# EAGLE design plotter (EAGLE 9.5.1)
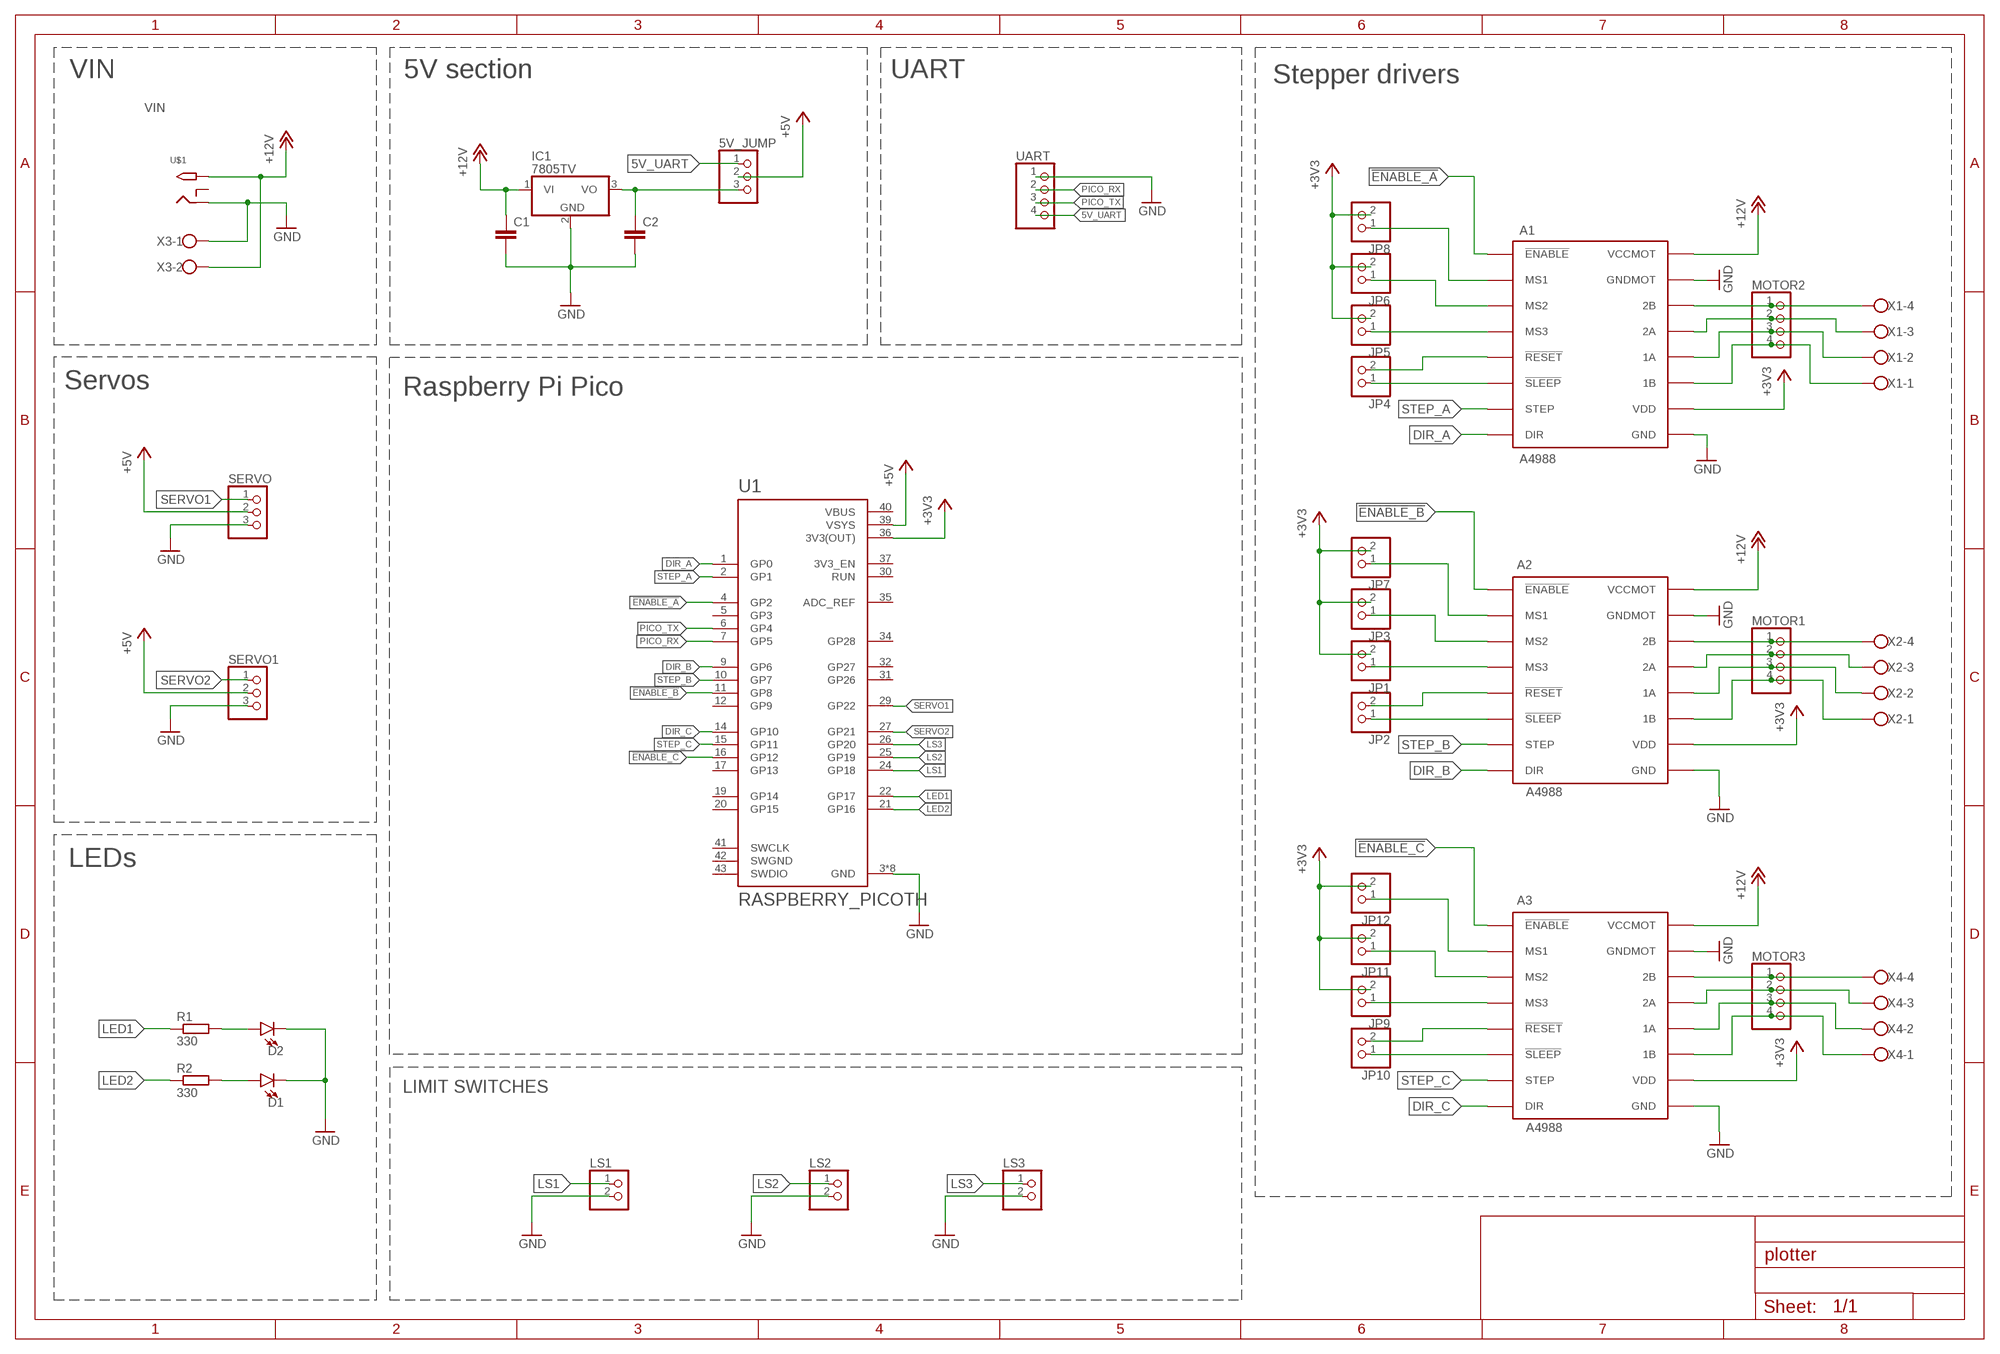
[diagram p0: schematic, sheet 1]

## Parts
5V_JUMP  PINHD-1X3  [1X03]
A1  A4988  [A4988]
A2  A4988  [A4988]
A3  A4988  [A4988]
C1  C-EUC0805  [C0805]
C2  C-EUC0805  [C0805]
D1  LED5MM  [LED_5MM]
D2  LED5MM  [LED_5MM]
IC1  7805TV  [TO220V]
JP1  PINHD-1X2  [1X02]
JP2  PINHD-1X2  [1X02]
JP3  PINHD-1X2  [1X02]
JP4  PINHD-1X2  [1X02]
JP5  PINHD-1X2  [1X02]
JP6  PINHD-1X2  [1X02]
JP7  PINHD-1X2  [1X02]
JP8  PINHD-1X2  [1X02]
JP9  PINHD-1X2  [1X02]
JP10  PINHD-1X2  [1X02]
JP11  PINHD-1X2  [1X02]
JP12  PINHD-1X2  [1X02]
LS1  PINHD-1X2  [1X02]
LS2  PINHD-1X2  [1X02]
LS3  PINHD-1X2  [1X02]
MOTOR1  PINHD-1X4  [1X04]
MOTOR2  PINHD-1X4  [1X04]
MOTOR3  PINHD-1X4  [1X04]
R1  330  R-EU_R0805  [R0805]
R2  330  R-EU_R0805  [R0805]
SERVO  PINHD-1X3  [1X03]
SERVO1  PINHD-1X3  [1X03]
U1  RASPBERRY_PICOTH  [PICO-PKG-TH]
U$1  2.1MMJACKTHM  [PJ-102A]
UART  PINHD-1X4  [1X04]
X1  W237-4  [W237-4]
X2  W237-4  [W237-4]
X3  W237-102  [W237-102]
X4  W237-4  [W237-4]

## Nets
5V_UART: 5V_JUMP.1 UART.4
!ENABLE_A: A1.!ENABLE U1.4(GP2)
!ENABLE_B: A2.!ENABLE U1.11(GP8)
!ENABLE_C: A3.!ENABLE U1.16(GP12)
+3V3: A1.VDD A2.VDD A3.VDD JP1.2 JP3.2 JP5.2 JP6.2 JP7.2 JP8.2 JP9.2 JP11.2 JP12.2 U1.36(3V3(OUT))
+5V: 5V_JUMP.2 SERVO1.2 SERVO.2 U1.39(VSYS)
+12V: A1.VCCMOT A2.VCCMOT A3.VCCMOT C1.1 IC1.1(VI) U$1.TIP X3.2
DIR_A: A1.DIR U1.1(GP0)
DIR_B: A2.DIR U1.9(GP6)
DIR_C: A3.DIR U1.14(GP10)
GND: A1.GND A1.GNDMOT A2.GND A2.GNDMOT A3.GND A3.GNDMOT C1.2 C2.2 D1.K(C) D2.K(C) IC1.2(GND) LS1.2 LS2.2 LS3.2 SERVO1.3 SERVO.3 U1.3(GND) U1.8(GND) U1.13(GND) U1.18(GND) U1.23(GND) U1.28(GND) U1.33(GND) U1.38(GND) U$1.RING UART.1 X3.1
LED1: R1.1 U1.22(GP17)
LED2: R2.1 U1.21(GP16)
LS1: LS1.1 U1.24(GP18)
LS2: LS2.1 U1.25(GP19)
LS3: LS3.1 U1.26(GP20)
N$1: A1.2B MOTOR2.1 X1.4
N$2: A1.2A MOTOR2.2 X1.3
N$3: A1.1A MOTOR2.3 X1.2
N$4: A1.1B MOTOR2.4 X1.1
N$5: A2.2B MOTOR1.1 X2.4
N$6: A2.2A MOTOR1.2 X2.3
N$7: A2.1A MOTOR1.3 X2.2
N$8: A2.1B MOTOR1.4 X2.1
N$9: 5V_JUMP.3 C2.1 IC1.3(VO)
N$10: D2.A R1.2
N$11: D1.A R2.2
N$12: A2.!SLEEP JP2.1
N$13: A2.!RESET JP2.2
N$14: A2.MS3 JP1.1
N$15: A2.MS2 JP3.1
N$16: A2.MS1 JP7.1
N$17: A1.!SLEEP JP4.1
N$18: A1.!RESET JP4.2
N$19: A1.MS3 JP5.1
N$20: A1.MS2 JP6.1
N$21: A1.MS1 JP8.1
N$22: A3.2B MOTOR3.1 X4.4
N$23: A3.2A MOTOR3.2 X4.3
N$24: A3.1A MOTOR3.3 X4.2
N$25: A3.1B MOTOR3.4 X4.1
N$26: A3.!SLEEP JP10.1
N$27: A3.!RESET JP10.2
N$28: A3.MS3 JP9.1
N$29: A3.MS2 JP11.1
N$30: A3.MS1 JP12.1
PICO_RX: U1.7(GP5) UART.2
PICO_TX: U1.6(GP4) UART.3
SERVO1: SERVO.1 U1.29(GP22)
SERVO2: SERVO1.1 U1.27(GP21)
STEP_A: A1.STEP U1.2(GP1)
STEP_B: A2.STEP U1.10(GP7)
STEP_C: A3.STEP U1.15(GP11)
Unconnected: U1.5(GP3) U1.12(GP9) U1.17(GP13) U1.19(GP14) U1.20(GP15) U1.30(RUN) U1.31(GP26) U1.32(GP27) U1.34(GP28) U1.35(ADC_REF) U1.37(3V3_EN) U1.41(SWCLK) U1.43(SWDIO) U$1.RING_SW

## Notes on the sheet
- VIN | 5V section | UART | Stepper drivers
- VIN
- Servos | Raspberry Pi Pico
- LEDs
- LIMIT SWITCHES

## Power pins joined to a net without a drawn wire
SWGND: U1.42(SWGND)
VBUS: U1.40(VBUS)

## Library data of the parts
5V_JUMP SERVO SERVO1 = pinhead:PINHD-1X3: PIN HEADER
A1-A3 = NikodemBartnik:A4988
C1 C2 = rcl:C-EU: CAPACITOR, European symbol; SPICEPREFIX: C
D1 D2 = SparkFun-LED:LED: LED (Generic) Standard schematic elements and footprints for 5mm, 3mm, 1206, and 0603 sized LEDs. Generic LEDs with no color specified.
IC1 = linear:78*: Positive VOLTAGE REGULATOR Source: http://cache.national.com/ds/LM/LM78L05.pdf http://www.fairchildsemi.com/ds/LM/LM7805.pdf
JP1-JP12 LS1-LS3 = pinhead:PINHD-1X2: PIN HEADER
MOTOR1-MOTOR3 UART = pinhead:PINHD-1X4: PIN HEADER
R1 R2 = rcl:R-EU_: RESISTOR, European symbol; SPICEPREFIX: R
U1 = RpiPico:RASPBERRY_PICO: Raspberry Pi Pico
U$1 = adafruit:2.1MMJACK: 2.1mm x 5.5mm THM DC jack with internal switch. Digikey part #PJ-102A, 4UCON part #05537 2.1mm x 5.5mm SMT DC jack with internal switch. Digikey part #PJ-002A-SMT, 4UCON part #03267 By microbuilder.eu & adafruit.com
X1 X2 X4 = con-wago-500:W237-4: WAGO SCREW CLAMP; OC_FARNELL: unknown; OC_NEWARK: unknown
X3 = con-wago-500:W237-102: WAGO SCREW CLAMP; MPN: 237-102; OC_FARNELL: unknown; OC_NEWARK: 70K9898

## Board
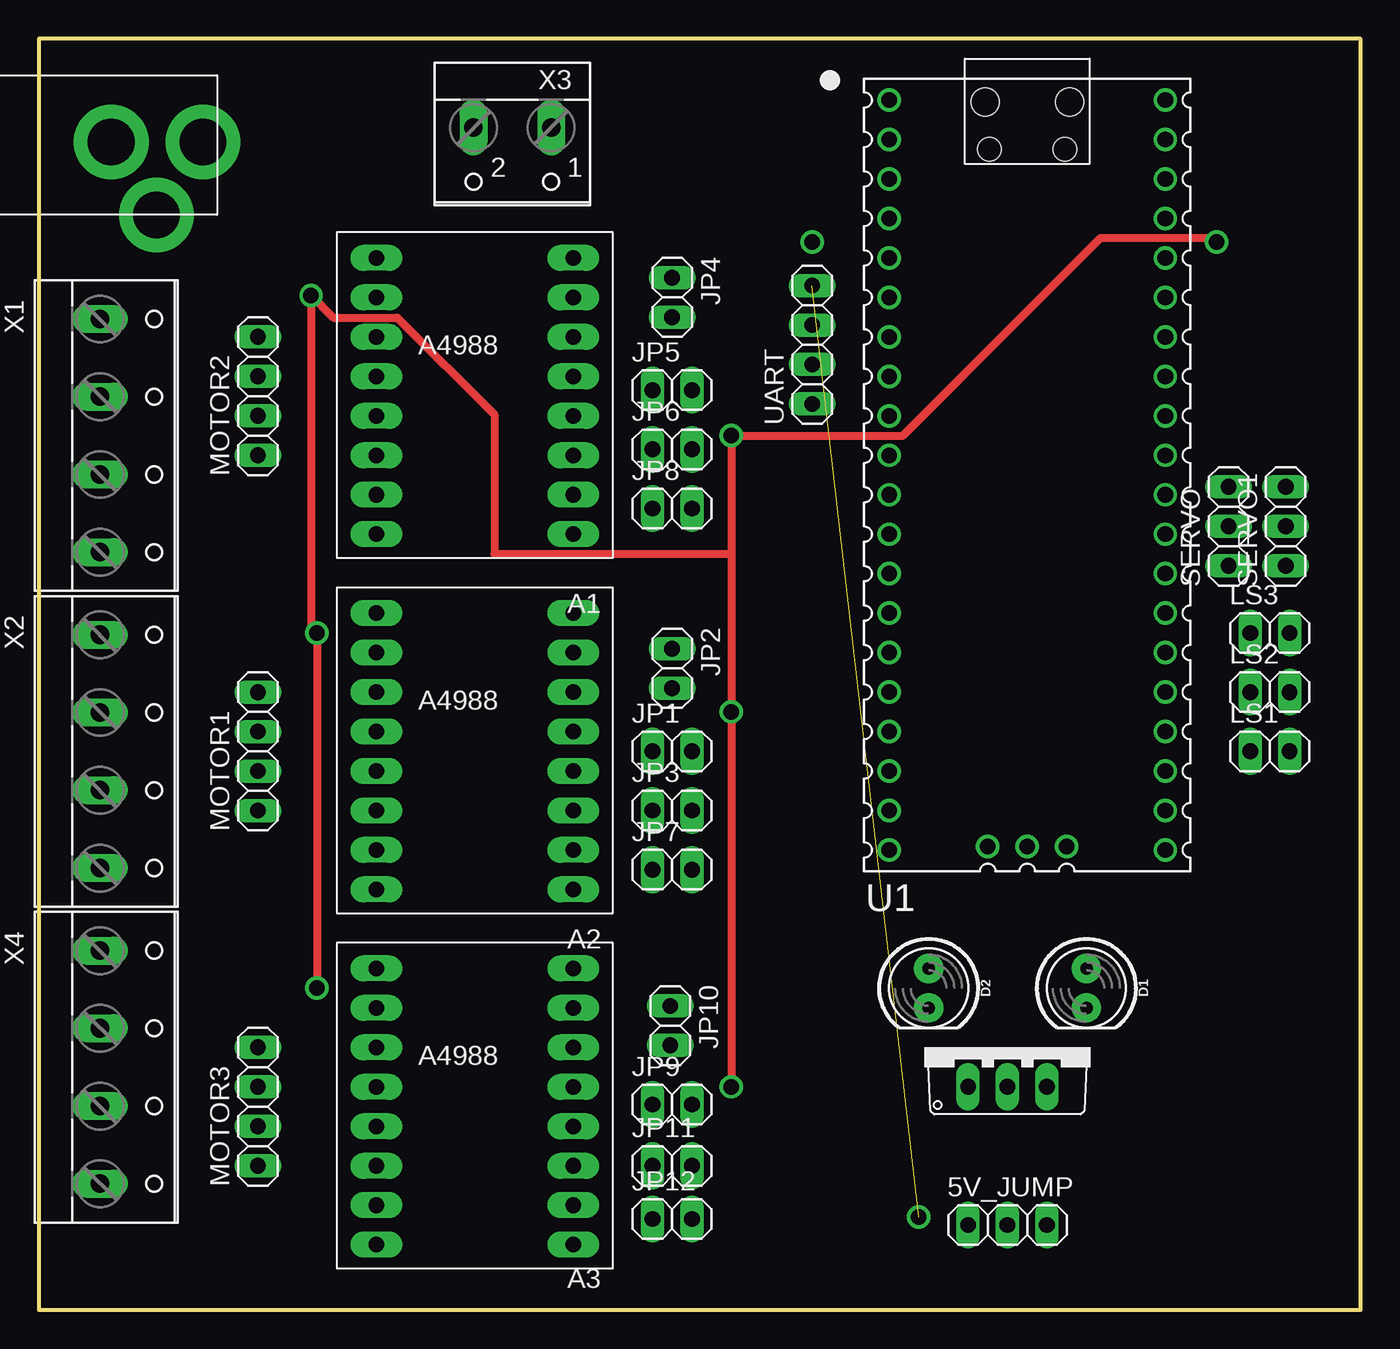
[diagram p1: board, top side]
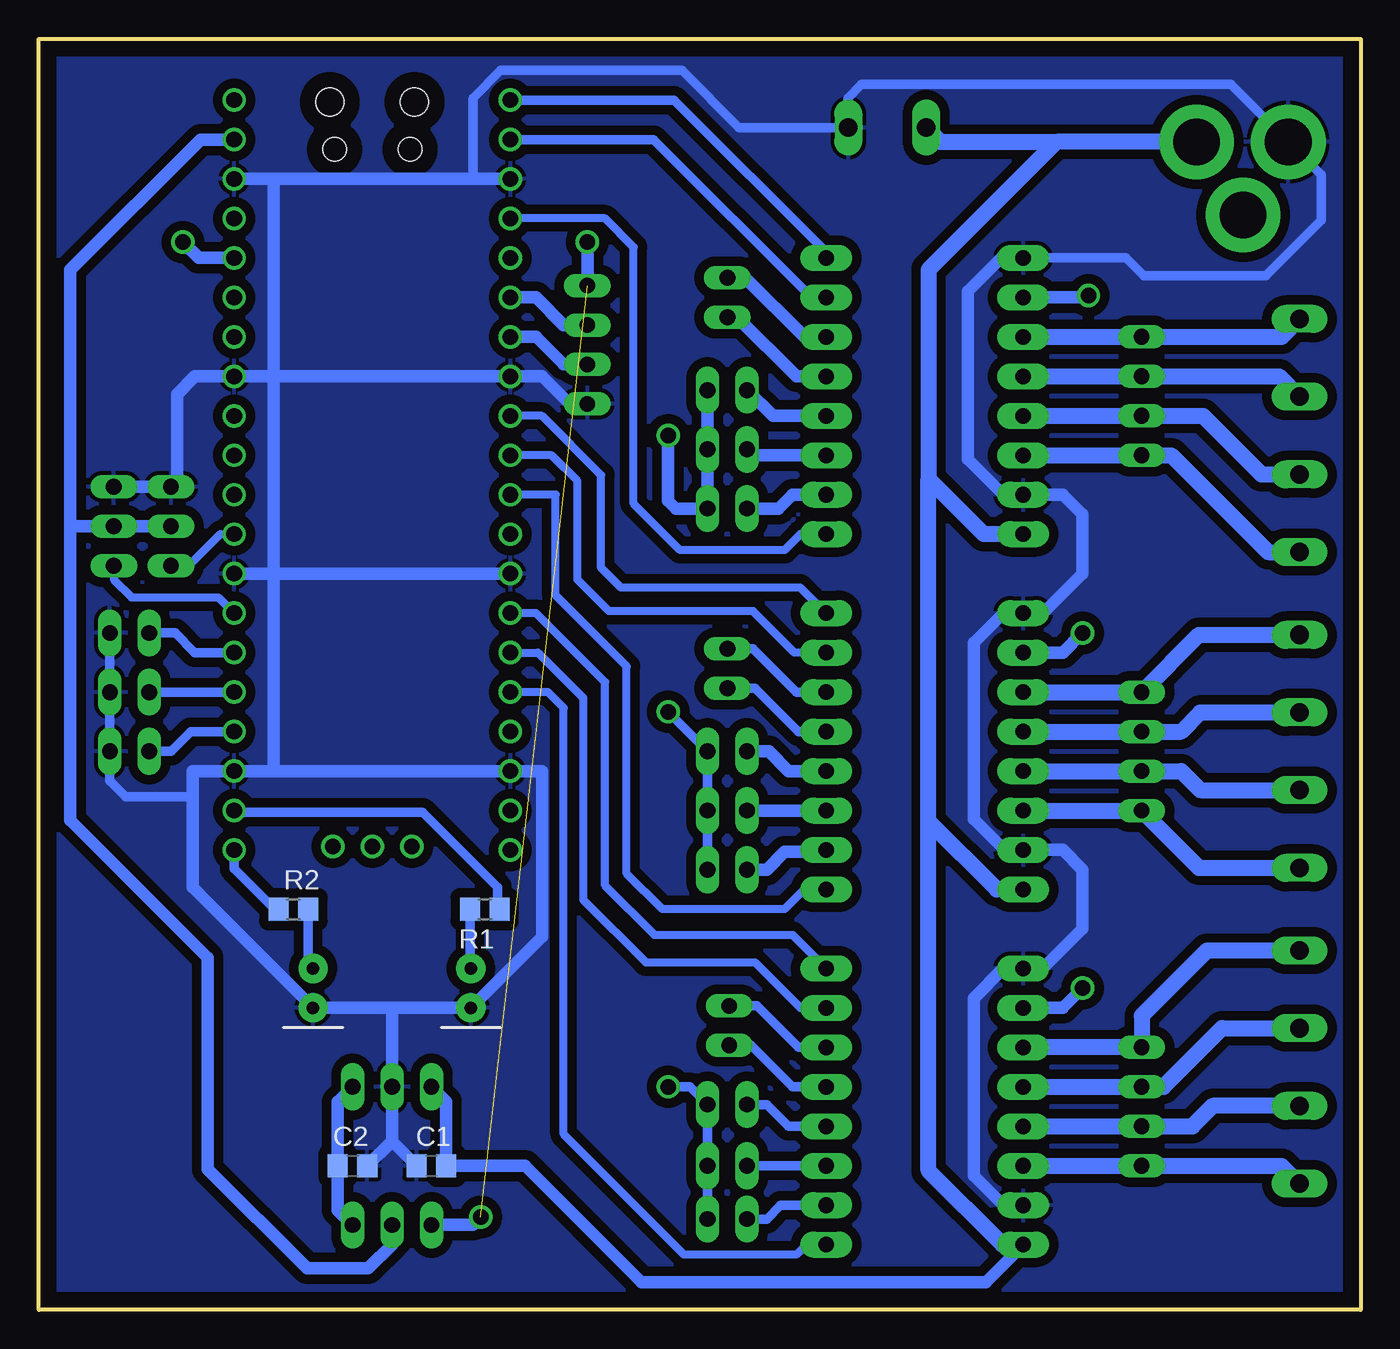
[diagram p2: board, bottom side, seen from below]

Size 85.09 x 81.79 mm. Coordinates in mm from the lower left corner, seen from the top.
Outline: 0,81.79 0,0 85.09,0 85.09,81.79 0,81.79
Copper layers (1*16): Top 0.035mm / dielectric 1.5mm / Bottom 0.035mm
Design rules "default": minimum track width 6mil, minimum drill 0.35mm, track to track 6mil, track to pad 6mil, pad to pad 6mil, via to via 6mil, smd to smd 6mil, copper to edge 40mil, drill to drill 6mil, minimum pad ring 10mil, minimum via ring 8mil, stop-mask expansion 4mil, vias tented up to drill 0mil, thermal gap 10mil

### Footprints (pad centres in the part's own frame; a part is rotated, then mirrored left to right if it is on the bottom)
1X03 = drill 1.016 long: 1 -2.54,0; 2 0,0; 3 2.54,0
A4988 = drill 1 pad 1.676 long: 1A 6.35,-1.27; 1B 6.35,-3.81; 2A 6.35,1.27; 2B 6.35,3.81; !ENABLE -6.35,8.89; !RESET -6.35,-1.27; !SLEEP -6.35,-3.81; DIR -6.35,-8.89; GND 6.35,-8.89; GNDMOT 6.35,6.35; MS1 -6.35,6.35; MS2 -6.35,3.81; MS3 -6.35,1.27; STEP -6.35,-6.35; VCCMOT 6.35,8.89; VDD 6.35,-6.35
C0805 = smd 1.3 x 1.5: 1 -0.95,0; 2 0.95,0
LED_5MM = drill 0.813 pad 1.88: A -1.27,0; K 1.27,0
TO220V = drill 1.016 long: 1 -2.54,-2.54; 2 0,-2.54; 3 2.54,-2.54
1X02 = drill 1.016 long: 1 -1.27,0; 2 1.27,0
1X04 = drill 1.016 long: 1 -3.81,0; 2 -1.27,0; 3 1.27,0; 4 3.81,0
R0805 = smd 1.3 x 1.5: 1 -0.95,0; 2 0.95,0
PICO-PKG-TH = drill 1: 1 -8.89,24.13; 2 -8.89,21.59; 3 -8.89,19.05; 4 -8.89,16.51; 5 -8.89,13.97; 6 -8.89,11.43; 7 -8.89,8.89; 8 -8.89,6.35; 9 -8.89,3.81; 10 -8.89,1.27; 11 -8.89,-1.27; 12 -8.89,-3.81; 13 -8.89,-6.35; 14 -8.89,-8.89; 15 -8.89,-11.43; 16 -8.89,-13.97; 17 -8.89,-16.51; 18 -8.89,-19.05; 19 -8.89,-21.59; 20 -8.89,-24.13; 21 8.89,-24.13; 22 8.89,-21.59; 23 8.89,-19.05; 24 8.89,-16.51; 25 8.89,-13.97; 26 8.89,-11.43; 27 8.89,-8.89; 28 8.89,-6.35; 29 8.89,-3.81; 30 8.89,-1.27; 31 8.89,1.27; 32 8.89,3.81; 33 8.89,6.35; 34 8.89,8.89; 35 8.89,11.43; 36 8.89,13.97; 37 8.89,16.51; 38 8.89,19.05; 39 8.89,21.59; 40 8.89,24.13; 41 -2.54,-23.9; 42 0,-23.9; 43 2.54,-23.9 | hole 1.8: -2.725,24; 2.725,24 | hole 1.5: -2.425,20.97; 2.425,20.97
PJ-102A = drill 3 pad 4.8: RING 0.1,-3.39; RING_SW -4.6,-6.29; TIP 0.1,-9.29
W237-4 = drill 1.194 long: 1 -7.5,-1.27; 2 -2.5,-1.27; 3 2.5,-1.27; 4 7.5,-1.27
W237-102 = drill 1.194 long: 1 -2.5,-1.27; 2 2.5,-1.27

### Placement (x,y rotation side)
5V_JUMP  62.36,5.46 0 top
A1  28.07,58.8 180 top
A2  28.07,35.94 180 top
A3  28.07,13.08 180 top
C1  59.82,9.27 180 bottom
C2  64.9,9.27 0 bottom
D1  67.44,20.7 270 top
D2  57.28,20.7 270 top
IC1  62.36,16.89 0 top
JP1  40.77,35.94 0 top
JP2  40.77,41.27 270 top
JP3  40.77,32.13 0 top
JP4  40.77,65.15 270 top
JP5  40.77,59.18 0 top
JP6  40.77,55.37 0 top
JP7  40.77,28.32 0 top
JP8  40.77,51.56 0 top
JP9  40.77,13.21 0 top
JP10  40.64,18.29 270 top
JP11  40.77,9.27 0 top
JP12  40.77,5.84 0 top
LS1  79.25,35.94 0 top
LS2  79.25,39.75 0 top
LS3  79.25,43.56 0 top
MOTOR1  14.1,35.94 90 top
MOTOR2  14.1,58.8 90 top
MOTOR3  14.1,13.08 90 top
R1  56.39,25.78 180 bottom
R2  68.71,25.78 0 bottom
SERVO  76.58,50.42 90 top
SERVO1  80.26,50.42 90 top
U1  63.63,53.72 0 top
U$1  1.27,75.06 90 top
UART  49.78,62.1 90 top
X1  5.21,56.26 270 top
X2  5.21,35.94 270 top
X3  30.48,74.8 180 top
X4  5.21,15.62 270 top

### Tracks (layer width: path | path; a pad name or v marks a point on that pad's centre or on a via)
5V_UART  (via drill 1)  (1 unrouted)
  Bottom 0.61: 49.02,65.91 UART.4
  Bottom 0.813: 5V_JUMP.1 57.15,5.46 v56.64,5.97 | v49.78,68.71 UART.4
!ENABLE_A
  Bottom 0.508: A1.!ENABLE 36.07,49.91 37.08,48.89 43.81,48.89 46.8,51.88 46.8,68.39 48.64,70.23 U1.4
!ENABLE_B
  Bottom 0.508: A2.!ENABLE 35.81,27.05 37.08,25.78 44.96,25.78 47.24,28.07 47.24,41.4 51.82,45.97 51.82,52.45 U1.11
!ENABLE_C
  Bottom 0.508: A3.!ENABLE 35.69,4.19 36.32,3.56 43.56,3.56 51.31,11.3 51.31,38.73 52.32,39.75 U1.16
+3V3  (via drill 1)
  Top 0.508: v17.91,20.7 v17.91,43.56 17.53,43.94 v17.53,65.28 18.95,63.86 23.07,63.86 29.34,57.59 29.34,48.64 44.58,48.64 | 44.58,48.64 v44.58,56.26 55.64,56.26 68.34,68.96 75.56,68.96 v75.82,68.71 | 44.58,48.64 v44.58,38.48 v44.58,14.35
  Bottom 0.61: JP7.2 JP3.2 JP1.2 v44.58,38.48 | JP12.2 JP11.2 JP9.2 43.18,14.35 v44.58,14.35
  Bottom 0.813: JP5.2 JP6.2 JP8.2 44.07,51.56 44.58,52.07 v44.58,56.26 | A1.VDD 17.65,65.15 v17.53,65.28 | v17.91,43.56 19.18,42.29 A2.VDD | v17.91,20.7 19.18,19.43 A3.VDD | v75.82,68.71 74.8,67.69 U1.36
+5V
  Bottom 0.813: U1.39 74.68,75.31 83.06,66.93 83.06,50.42 | 5V_JUMP.2 62.36,4.19 63.88,2.67 67.82,2.67 74.21,9.06 74.21,22.65 83.06,31.5 83.06,50.42 | SERVO.2 SERVO1.2 83.06,50.42
+12V
  Bottom 0.508: 22.99,4.19 23.01,4.22 23.07,4.22
  Bottom 0.813: IC1.1 58.87,13.4 C1.1 53.79,9.27 46.29,1.78 24.13,1.78 A3.VCCMOT
  Bottom 1.016: A1.VCCMOT 24.26,49.91 27.81,53.47 | A2.VCCMOT 23.43,27.05 27.81,31.44 | 27.81,31.44 27.81,53.47 | A3.VCCMOT 22.99,4.19 | 23.07,4.22 27.81,8.96 27.81,31.44 | U$1.TIP 19.59,75.16 | 27.81,53.47 27.81,66.93 19.59,75.16 | X3.2 27.06,75.16 19.59,75.16
DIR_A
  Bottom 0.61: A1.DIR 34.42,68.07 44.2,77.85 U1.1
DIR_B
  Bottom 0.508: U1.9 52.7,57.53 48.89,53.72 48.89,47.75 47.62,46.48 36.07,46.48 A2.DIR
DIR_C
  Bottom 0.508: A3.DIR 36.58,24.13 45.47,24.13 48.64,27.3 48.64,40.39 53.09,44.83 U1.14
GND
  Bottom 0.508: 23.06,67.76 22.99,67.69 | U1.38 69.98,72.77
  Bottom 0.61: LS3.2 LS2.2 LS1.2 80.52,34.04 79.5,33.02 75.18,33.02 | A1.GND 15.11,67.69 13.97,66.55 6.1,66.55 2.54,70.1 2.54,73.04 U$1.RING 8.37,78.87 32.13,78.87 33.02,77.98 33.02,76.11 X3.1 40,76.07 43.69,79.76 55.37,79.76 57.15,77.98 57.15,72.77
  Bottom 0.813: 23.06,67.76 25.27,65.54 25.27,54.74 22.99,52.45 A1.GNDMOT 19.18,52.45 17.91,51.18 17.91,47.37 20.45,44.83 A2.GND 22.99,44.83 24.89,42.93 24.89,31.57 22.92,29.59 A2.GNDMOT 19.18,29.59 17.91,28.32 17.91,24.51 20.45,21.97 A3.GND 22.99,21.97 24.89,20.07 24.89,8.64 22.99,6.73 A3.GNDMOT | A1.GND 22.99,67.69 | D1.K D2.K 52.7,24 52.7,34.67 U1.18 U1.23 75.18,34.67 75.18,33.02 75.18,27.18 D1.K | 69.98,60.07 U1.33 75.06,60.07 76.2,58.93 76.2,53.34 SERVO.3 SERVO1.3 | 69.98,72.77 69.98,60.07 | U1.3 57.15,72.77 U1.38 | U1.13 69.98,47.37 | 69.98,47.37 U1.28 | 69.98,47.37 69.98,34.67 | 69.98,60.07 U1.8 52.7,60.07 50.93,58.29 UART.1 | 62.36,10.86 C2.2 | 62.36,10.86 IC1.2 62.36,19.43 D1.K | C1.2 62.36,10.86 | 69.98,60.07 69.98,47.37
  pour Bottom (isolate 0.61): -0.13,81.15 -0.13,-0.13 84.96,-0.13 84.96,81.15 84.96,81.79 -0.13,81.79
LED1
  Bottom 0.61: U1.22 72.39,32 60.39,32 55.56,27.18 55.56,25.91 R1.1
LED2
  Bottom 0.61: R2.1 69.91,25.78 72.52,28.39 U1.21
LS1
  Bottom 0.61: LS1.1 76.58,35.94 75.31,37.21 U1.24
LS2
  Bottom 0.61: LS2.1 U1.25
LS3
  Bottom 0.61: LS3.1 76.33,43.56 75.06,42.29 U1.26
N$1
  Bottom 1.016: A1.2B MOTOR2.1 12.19,54.99 5.96,48.76 X1.4
N$2
  Bottom 1.016: A1.2A MOTOR2.2 10.16,57.53 6.39,53.76 X1.3
N$3
  Bottom 1.016: A1.1A MOTOR2.3 5.25,60.07 X1.2
N$4
  Bottom 1.016: A1.1B MOTOR2.4 5.08,62.62 X1.1
N$5
  Bottom 1.016: A2.2B MOTOR1.1 10.41,28.44 X2.4
N$6
  Bottom 1.016: A2.2A MOTOR1.2 11.56,34.67 10.33,33.44 X2.3
N$7
  Bottom 1.016: A2.1A MOTOR1.3 11.56,37.21 10.33,38.44 X2.2
N$8
  Bottom 1.016: A2.1B MOTOR1.4 10.41,43.44 X2.1
N$9
  Bottom 0.813: IC1.3 65.85,13.4 C2.1 65.85,6.41 5V_JUMP.3
N$10
  Bottom 0.61: R1.2 57.34,22.03 D2.A
N$11
  Bottom 0.61: R2.2 67.76,22.29 D1.A
N$12
  Bottom 0.61: A2.!SLEEP 36.32,39.75 39.12,42.54 JP2.1
N$13
  Bottom 0.61: A2.!RESET 36.2,37.21 38.99,40 JP2.2
N$14
  Bottom 0.813: JP1.1 38.1,35.94 36.83,34.67 A2.MS3
N$15
  Bottom 0.813: A2.MS2 JP3.1
N$16
  Bottom 0.813: A2.MS1 34.54,29.46 37.08,29.46 38.23,28.32 JP7.1
N$17
  Bottom 0.813: JP4.1 39.62,66.42 35.81,62.61 A1.!SLEEP
N$18
  Bottom 0.813: JP4.2 40.13,63.88 36.32,60.07 A1.!RESET
N$19
  Bottom 0.813: JP5.1 37.85,57.53 A1.MS3
N$20
  Bottom 0.813: JP6.1 39.5,54.99 A1.MS2
N$21
  Bottom 0.813: A1.MS1 36.58,52.45 37.46,51.56 JP8.1
N$22
  Bottom 1.016: A3.2B MOTOR3.1 5.08,9.26 X4.4
N$23
  Bottom 1.016: A3.2A MOTOR3.2 10.83,11.81 9.52,13.12 X4.3
N$24
  Bottom 1.016: A3.1A MOTOR3.3 12.7,14.35 8.93,18.12 X4.2
N$25
  Bottom 1.016: A3.1B MOTOR3.4 14.1,18.92 9.9,23.12 X4.1
N$26
  Bottom 0.61: A3.!SLEEP 36.2,16.89 38.86,19.56 JP10.1
N$27
  Bottom 0.61: A3.!RESET 36.58,14.35 39.24,17.02 JP10.2
N$28
  Bottom 0.61: JP9.1 38.23,13.21 36.83,11.81 A3.MS3
N$29
  Bottom 0.61: A3.MS2 JP11.1
N$30
  Bottom 0.61: A3.MS1 37.34,6.73 38.23,5.84 JP12.1
PICO_RX
  Bottom 0.813: U1.7 53.09,62.61 51.31,60.83 UART.2
PICO_TX
  Bottom 0.813: U1.6 53.09,65.15 51.31,63.37 UART.3
SERVO1
  Bottom 0.508: SERVO.1 75.44,47.88 73.41,49.91 U1.29
SERVO2
  Bottom 0.508: SERVO1.1 80.26,46.99 79.12,45.85 73.53,45.85 U1.27
STEP_A
  Bottom 0.508: A1.STEP 34.44,65.18
  Bottom 0.61: 34.44,65.18 35.39,65.18 45.52,75.31 U1.2
STEP_B
  Bottom 0.508: A2.STEP 36.45,42.29 39.12,44.96 48.39,44.96 50.42,46.99 50.42,53.34 52.07,54.99 U1.10
STEP_C
  Bottom 0.508: U1.15 52.96,42.29 50.04,39.37 50.04,26.37 46.02,22.35 38.99,22.35 36.07,19.43 A3.STEP